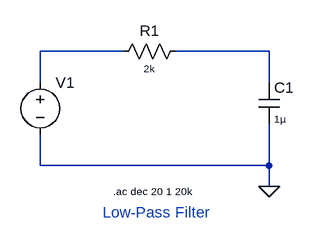
[diagram p0: schematic Low_Pass_Filter.asc]
Low_Pass_Filter.asc, the LTspice schematic file:
Version 4
SHEET 1 880 680
WIRE 304 272 176 272
WIRE 528 272 384 272
WIRE 176 320 176 272
WIRE 528 320 528 272
WIRE 176 448 176 400
WIRE 528 448 528 384
WIRE 528 448 176 448
WIRE 528 480 528 448
FLAG 528 480 0
SYMBOL Res 288 288 R270
WINDOW 0 32 56 VTop 2
WINDOW 3 0 56 VBottom 1
SYMATTR InstName R1
SYMATTR Value 2k
SYMBOL Cap 512 320 R0
WINDOW 3 24 56 Left 1
SYMATTR Value 1µ
SYMATTR InstName C1
SYMBOL Voltage 176 304 R0
SYMATTR InstName V1
SYMATTR Value ""
SYMATTR Value2 AC 1
TEXT 288 488 Left 1 !.ac dec 20 1 20k
TEXT 272 520 Left 2 ;Low-Pass Filter

The netlist it stands for:
* Low_Pass_Filter.asc
R1 N001 N002 2k
C1 N002 0 1µ
V1 N001 0 AC 1
.ac dec 20 1 20k
* Low-Pass Filter
.backanno
.end